# EAGLE design uno (EAGLE 9.6.0)
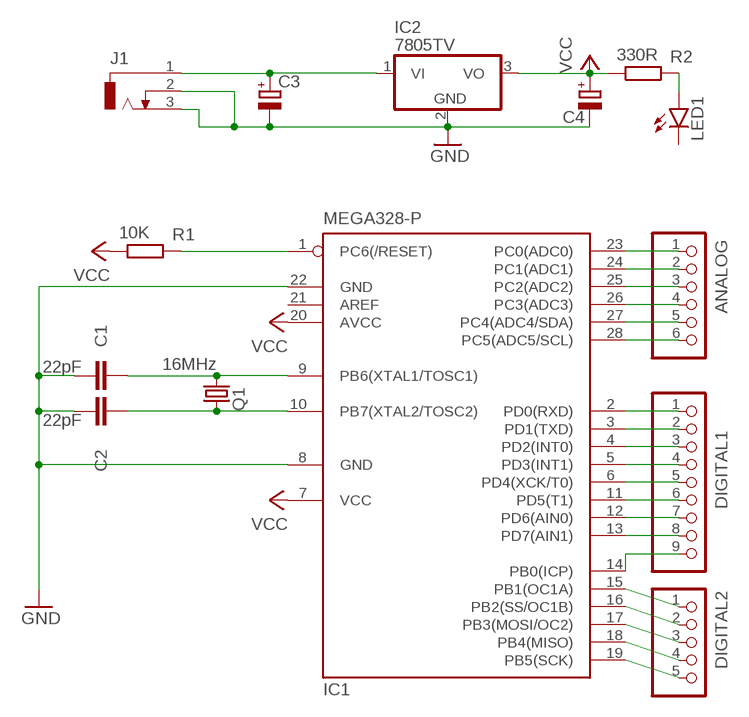
[diagram p0: schematic, sheet 1]

## Parts
ANALOG  PINHD-1X6  [1X06]
C1  22pF  C-EU025-024X044  [C025-024X044]
C2  22pF  C-EU025-024X044  [C025-024X044]
C3  CPOL-EUE2.5-6  [E2,5-6]
C4  CPOL-EUE2.5-6  [E2,5-6]
DIGITAL1  PINHD-1X9  [1X09]
DIGITAL2  PINHD-1X5  [1X05]
IC1  MEGA328-P  MEGA8-P  [DIL28-3]
IC2  7805TV  [TO220V]
J1  DCJ0303  [DCJ0303]
LED1  LED3MM  [LED3MM]
Q1  16MHz  CRYSTALHC49U70  [HC49U70]
R1  10K  R-EU_0207/10  [0207/10]
R2  330R  R-EU_0207/10  [0207/10]

## Nets
GND: C1.1 C2.1 C3.- C4.- IC1.8(GND) IC1.22(GND) IC2.2(GND) J1.2 J1.3
N$1: IC1.1(PC6(/RESET)) R1.2
N$2: C1.2 IC1.9(PB6(XTAL1/TOSC1)) Q1.2
N$3: C2.2 IC1.10(PB7(XTAL2/TOSC2)) Q1.1
N$4: ANALOG.1 IC1.23(PC0(ADC0))
N$5: ANALOG.2 IC1.24(PC1(ADC1))
N$6: ANALOG.3 IC1.25(PC2(ADC2))
N$7: ANALOG.4 IC1.26(PC3(ADC3))
N$8: ANALOG.5 IC1.27(PC4(ADC4/SDA))
N$9: ANALOG.6 IC1.28(PC5(ADC5/SCL))
N$10: DIGITAL1.1 IC1.2(PD0(RXD))
N$11: DIGITAL1.2 IC1.3(PD1(TXD))
N$12: DIGITAL1.3 IC1.4(PD2(INT0))
N$13: DIGITAL1.4 IC1.5(PD3(INT1))
N$14: DIGITAL1.5 IC1.6(PD4(XCK/T0))
N$15: DIGITAL1.6 IC1.11(PD5(T1))
N$16: DIGITAL1.7 IC1.12(PD6(AIN0))
N$17: DIGITAL1.8 IC1.13(PD7(AIN1))
N$18: DIGITAL1.9 IC1.14(PB0(ICP))
N$19: DIGITAL2.1 IC1.15(PB1(OC1A))
N$20: DIGITAL2.2 IC1.16(PB2(SS/OC1B))
N$21: DIGITAL2.3 IC1.17(PB3(MOSI/OC2))
N$22: DIGITAL2.4 IC1.18(PB4(MISO))
N$23: DIGITAL2.5 IC1.19(PB5(SCK))
N$24: C3.+ IC2.1(VI) J1.1
N$27: LED1.A R2.2
VCC: C4.+ IC1.7(VCC) IC1.20(AVCC) IC2.3(VO) R1.1 R2.1
Unconnected: IC1.21(AREF) LED1.K(C)

## Library data of the parts
ANALOG = pinhead:PINHD-1X6: PIN HEADER
C1 C2 = rcl:C-EU: CAPACITOR, European symbol; SPICEPREFIX: C
C3 C4 = rcl:CPOL-EU: POLARIZED CAPACITOR, European symbol; SPICEPREFIX: C
DIGITAL1 = pinhead:PINHD-1X9: PIN HEADER
DIGITAL2 = pinhead:PINHD-1X5: PIN HEADER
IC1 = atmel:MEGA8-P: MICROCONTROLLER 8 Kbytes FLASH, 1 kbytes SRAM, 512 bytes EEPROM, USART, 4-channel 10 bit ADC, 2-channel 8 bit ADC Pin compatible with Atmega48, ATMega88, ATMega168 Source: avr.lbr; OC_FARNELL: unknown; OC_NEWARK: unknown
IC2 = linear:78*: Positive VOLTAGE REGULATOR Source: http://cache.national.com/ds/LM/LM78L05.pdf http://www.fairchildsemi.com/ds/LM/LM7805.pdf
J1 = con-jack:DCJ0303: DC POWER JACK Source: DCJ0303.pdf; OC_FARNELL: unknown; OC_NEWARK: unknown
LED1 = led:LED: LED OSRAM: - CHIPLED LG R971, LG N971, LY N971, LG Q971, LY Q971, LO R971, LY R971 LH N974, LH R974 LS Q976, LO Q976, LY Q976 LO Q996 - Hyper CHIPLED LW Q18S LB Q993, LB Q99A, LB R99A - SideLED LS A670, LO A670, LY A670, LG A670, LP A670 LB A673, LV A673, LT A673, LW A673 LH A674 LY A675 LS A676, LA A676, LO A676, LY A676, LW A676 LS A679, LY A679, LG A679 - Hyper Micro SIDELED® LS Y876, LA Y876, LO Y876, LY Y876 LT Y87S - SmartLED LW L88C, LW L88S LB L89C, LB L89S, LG L890 LS L89K, LO L89K, LY L89K LS L896, LA L896, LO L896, LY L896 - TOPLED LS T670, LO T670, LY T670, LG T670, LP T670 LSG T670, LSP T670, LSY T670, LOP T670, LYG T670 LG T671, LOG T671, LSG T671 LB T673, LV T673, LT T673, LW T673 LH T674 LS T676, LA T676, LO T676, LY T676, LB T676, LH T676, LSB T676, LW T676 LB T67C, LV T67C, LT T67C, LS T67K, LO T67K, LY T67K, LW E67C LS E67B, LA E67B, LO E67B, LY E67B, LB E67C, LV E67C, LT E67C LW T67C LS T679, LY T679, LG T679 LS T770, LO T770, LY T770, LG T770, LP T770 LB T773, LV T773, LT T773, LW T773 LH T774 LS E675, LA E675, LY E675, LS T675 LS T776, LA T776, LO T776, LY T776, LB T776 LHGB T686 LT T68C, LB T68C - Hyper Mini TOPLED® LB M676 - Mini TOPLED Santana® LG M470 LS M47K, LO M47K, LY M47K Source: http://www.osram.convergy.de LUXEON: - LUMILED® LXK2-PW12-R00, LXK2-PW12-S00, LXK2-PW14-U00, LXK2-PW14-V00 LXK2-PM12-R00, LXK2-PM12-S00, LXK2-PM14-U00 LXK2-PE12-Q00, LXK2-PE12-R00, LXK2-PE12-S00, LXK2-PE14-T00, LXK2-PE14-U00 LXK2-PB12-K00, LXK2-PB12-L00, LXK2-PB12-M00, LXK2-PB14-N00, LXK2-PB14-P00, LXK2-PB14-Q00 LXK2-PR12-L00, LXK2-PR12-M00, LXK2-PR14-Q00, LXK2-PR14-R00 LXK2-PD12-Q00, LXK2-PD12-R00, LXK2-PD12-S00 LXK2-PH12-R00, LXK2-PH12-S00 LXK2-PL12-P00, LXK2-PL12-Q00, LXK2-PL12-R00 Source: www.luxeon.com KINGBRIGHT: KA-3528ASYC Source: www.kingbright.com
Q1 = crystal:CRYSTAL: CRYSTAL; OC_FARNELL: unknown; OC_NEWARK: unknown
R1 R2 = rcl:R-EU_: RESISTOR, European symbol; SPICEPREFIX: R

## Board
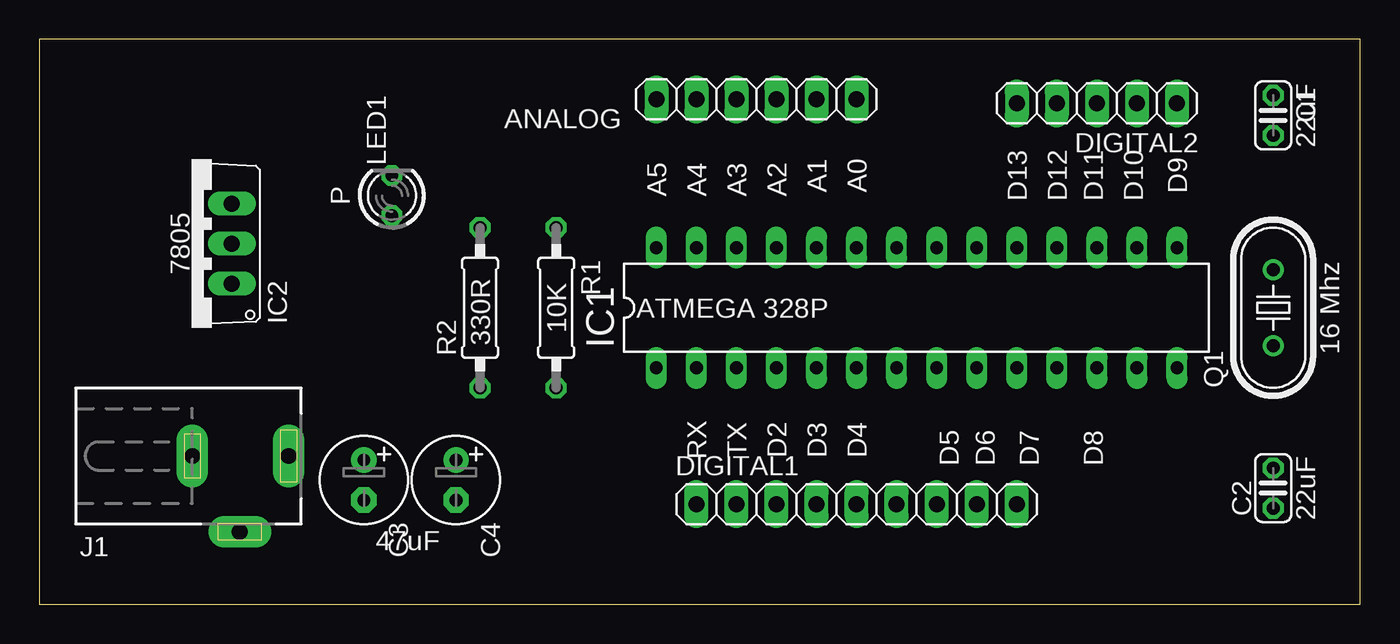
[diagram p1: board, top side]
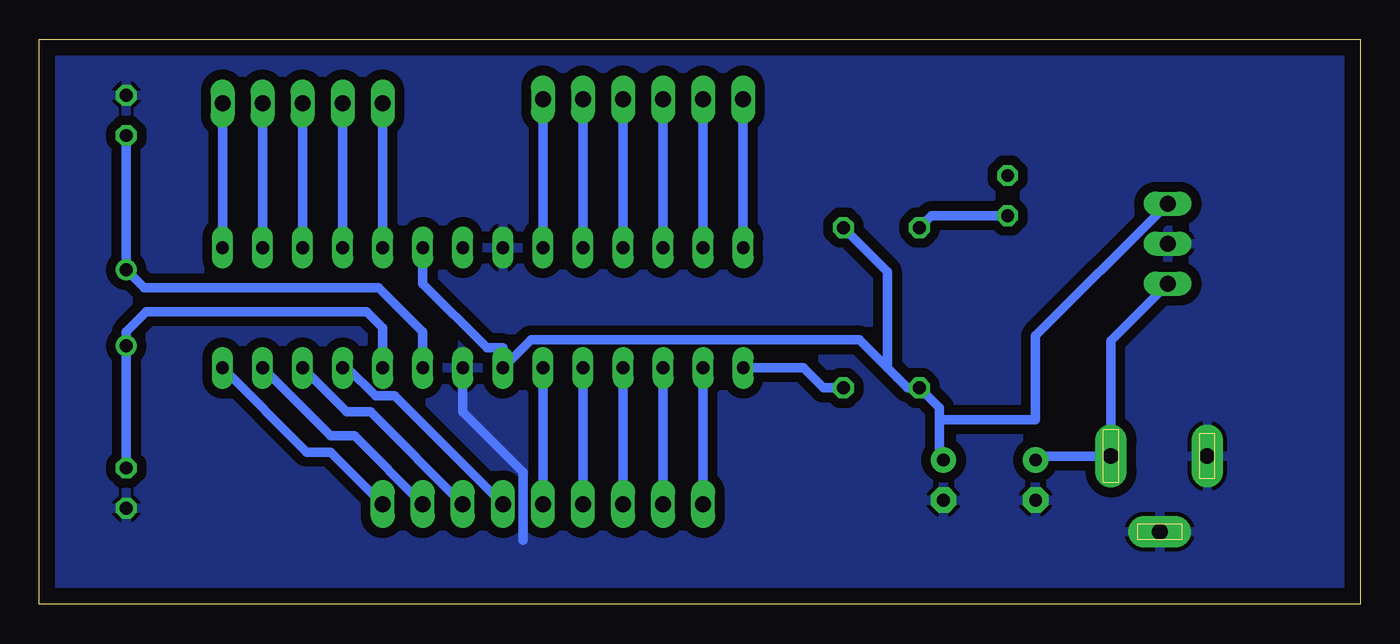
[diagram p2: board, bottom side, seen from below]

Size 83.74 x 35.8 mm. Coordinates in mm from the lower left corner, seen from the top.
Outline: 0,0 83.74,0 83.74,35.8 0,35.8 0,0
Copper layers (1*16): Top 0.035mm / dielectric 1.5mm / Bottom 0.035mm
Design rules "default": minimum track width 6mil, minimum drill 0.35mm, track to track 6mil, track to pad 6mil, pad to pad 6mil, via to via 6mil, smd to smd 6mil, copper to edge 40mil, drill to drill 6mil, minimum pad ring 10mil, minimum via ring 8mil, stop-mask expansion 4mil, vias tented up to drill 0mil, thermal gap 10mil

### Footprints (pad centres in the part's own frame; a part is rotated, then mirrored left to right if it is on the bottom)
1X06 = drill 1.016 long: 1 -6.35,0; 2 -3.81,0; 3 -1.27,0; 4 1.27,0; 5 3.81,0; 6 6.35,0
C025-024X044 = drill 0.813 octagon: 1 -1.27,0; 2 1.27,0
E2,5-6 = drill 0.813 pad 1.6: + -1.27,0 | drill 0.813 pad 1.6 octagon: - 1.27,0
1X09 = drill 1.016 long: 1 -10.16,0; 2 -7.62,0; 3 -5.08,0; 4 -2.54,0; 5 0,0; 6 2.54,0; 7 5.08,0; 8 7.62,0; 9 10.16,0
1X05 = drill 1.016 long: 1 -5.08,0; 2 -2.54,0; 3 0,0; 4 2.54,0; 5 5.08,0
DIL28-3 = drill 0.813 long: 1 -16.51,-3.81; 2 -13.97,-3.81; 3 -11.43,-3.81; 4 -8.89,-3.81; 5 -6.35,-3.81; 6 -3.81,-3.81; 7 -1.27,-3.81; 8 1.27,-3.81; 9 3.81,-3.81; 10 6.35,-3.81; 11 8.89,-3.81; 12 11.43,-3.81; 13 13.97,-3.81; 14 16.51,-3.81; 15 16.51,3.81; 16 13.97,3.81; 17 11.43,3.81; 18 8.89,3.81; 19 6.35,3.81; 20 3.81,3.81; 21 1.27,3.81; 22 -1.27,3.81; 23 -3.81,3.81; 24 -6.35,3.81; 25 -8.89,3.81; 26 -11.43,3.81; 27 -13.97,3.81; 28 -16.51,3.81
TO220V = drill 1.016 long: 1 -2.54,-2.54; 2 0,-2.54; 3 2.54,-2.54
DCJ0303 = drill 1 pad 2 long: 1 0,3.1; 2 4.8,0; 3 0,-3
LED3MM = drill 0.813 octagon: A -1.27,0; K 1.27,0
HC49U70 = drill 0.813: 1 -2.413,0; 2 2.413,0
0207/10 = drill 0.813 octagon: 1 -5.08,0; 2 5.08,0

### Placement (x,y rotation side)
ANALOG  45.47,32 180 top
C1  78.23,30.99 270 top
C2  78.23,7.37 90 top
C3  20.57,7.87 270 top
C4  26.42,7.87 270 top
DIGITAL1  51.82,6.35 0 top
DIGITAL2  67.06,31.75 180 top
IC1  55.63,18.8 0 top
IC2  9.65,22.86 90 top
J1  12.7,9.4 270 top
LED1  22.35,25.91 90 top
Q1  78.23,18.8 90 top
R1  32.77,18.8 270 top
R2  27.94,18.8 90 top

### Tracks (layer width: path | path; a pad name or v marks a point on that pad's centre or on a via)
GND
  Bottom 0.61: IC1.8 56.9,12.19 53.09,8.38 53.09,4.06
  pour Bottom (isolate 0.61): 0,35.81 83.82,35.81 83.82,0 0,0
N$1
  Bottom 0.61: R1.2 34.04,13.72 35.31,14.99 IC1.1
N$2
  Bottom 0.61: IC1.9 59.44,17.27 62.23,20.07 77.09,20.07 Q1.2 C1.2
N$3
  Bottom 0.61: IC1.10 61.98,17.53 62.99,18.54 76.96,18.54 78.23,17.27 Q1.1 C2.2
N$4
  Bottom 0.61: ANALOG.1 IC1.23
N$5
  Bottom 0.61: ANALOG.2 IC1.24
N$6
  Bottom 0.61: ANALOG.3 IC1.25
N$7
  Bottom 0.61: ANALOG.4 IC1.26
N$8
  Bottom 0.61: ANALOG.5 IC1.27
N$9
  Bottom 0.61: ANALOG.6 IC1.28
N$10
  Bottom 0.61: DIGITAL1.1 IC1.2
N$11
  Bottom 0.61: DIGITAL1.2 IC1.3
N$12
  Bottom 0.61: DIGITAL1.3 IC1.4
N$13
  Bottom 0.61: DIGITAL1.4 IC1.5
N$14
  Bottom 0.61: DIGITAL1.5 IC1.6
N$15
  Bottom 0.61: DIGITAL1.6 61.21,13.21 62.44,13.21 64.22,14.99 IC1.11
N$16
  Bottom 0.61: IC1.12 64.26,12.19 62.74,12.19 DIGITAL1.7
N$17
  Bottom 0.61: DIGITAL1.8 63.75,10.67 65.28,10.67 IC1.13
N$18
  Bottom 0.61: IC1.14 66.8,9.65 65.28,9.65 DIGITAL1.9
N$19
  Bottom 0.61: DIGITAL2.1 IC1.15
N$20
  Bottom 0.61: DIGITAL2.2 IC1.16
N$21
  Bottom 0.61: DIGITAL2.3 IC1.17
N$22
  Bottom 0.61: DIGITAL2.4 IC1.18
N$23
  Bottom 0.61: DIGITAL2.5 IC1.19
N$24
  Bottom 0.61: C3.+ 20.32,9.4 J1.1 15.8,16.71 IC2.1
N$27
  Bottom 0.61: LED1.A 27.18,24.64 R2.2
VCC
  Bottom 0.61: IC2.3 12.45,25.15 | 12.45,25.15 20.57,17.02 20.57,11.68 26.67,11.68 | 26.67,11.68 26.67,9.4 C4.+ | 12.7,25.4 12.45,25.15 | R1.1 29.97,21.08 29.97,14.99 | 29.97,14.99 29.34,14.35 28.7,13.72 R2.1 26.67,12.45 26.67,11.68 | IC1.20 59.44,20.32 55.37,16.26 54.36,16.26 IC1.7 52.58,16.76 31.75,16.76 29.97,14.99

### Text on the board
tPlace: 22uF | A5 | A4 | A3 | A2 | A1 | A0 | D13 | D12 | D11 | D10 | D9 | P | 7805 | 330R | 10K | ATMEGA 328P | 16 Mhz | RX | TX | D2 | D3 | D4 | D5 | D6 | D7 | D8 | 22uF | 47uF